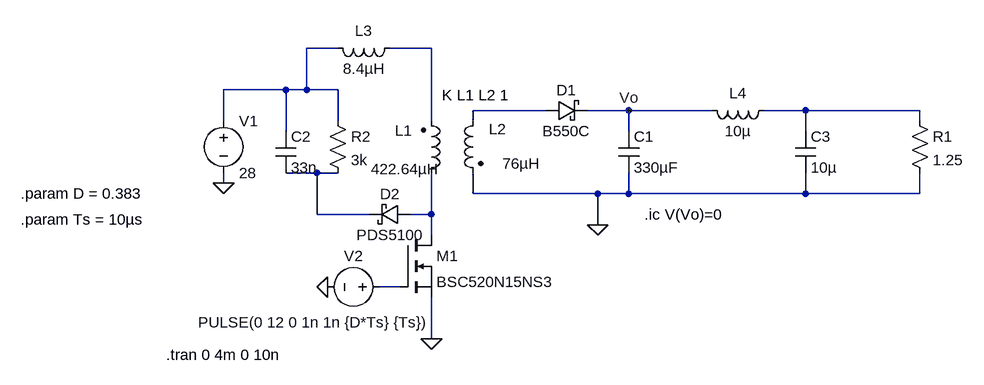
[diagram p0: schematic Flyback_Converter_2nd_Draft.asc]
Flyback_Converter_2nd_Draft.asc, the LTspice schematic file:
Version 4
SHEET 1 1176 680
WIRE 16 -32 -32 -32
WIRE 160 -32 96 -32
WIRE -64 32 -160 32
WIRE -32 32 -32 -32
WIRE -32 32 -64 32
WIRE 16 32 -32 32
WIRE 336 64 224 64
WIRE 464 64 400 64
WIRE 592 64 464 64
WIRE 736 64 672 64
WIRE 912 64 736 64
WIRE -160 80 -160 32
WIRE 16 80 16 32
WIRE 160 80 160 -32
WIRE 224 80 224 64
WIRE 912 80 912 64
WIRE -64 96 -64 32
WIRE 464 96 464 64
WIRE 736 96 736 64
WIRE -16 160 -64 160
WIRE 16 160 -16 160
WIRE -160 176 -160 160
WIRE 224 192 224 160
WIRE 416 192 224 192
WIRE 464 192 464 160
WIRE 464 192 416 192
WIRE 736 192 736 160
WIRE 736 192 464 192
WIRE 912 192 912 160
WIRE 912 192 736 192
WIRE -16 224 -16 160
WIRE 64 224 -16 224
WIRE 160 224 160 160
WIRE 160 224 128 224
WIRE 416 240 416 192
WIRE 160 256 160 224
WIRE 112 336 80 336
WIRE 160 416 160 352
FLAG -160 176 0
FLAG 0 336 0
FLAG 160 416 0
FLAG 416 240 0
FLAG 464 64 Vo
SYMBOL voltage -160 64 R0
WINDOW 123 0 0 Left 2
WINDOW 39 0 0 Left 2
SYMATTR InstName V1
SYMATTR Value 28
SYMBOL ind2 144 176 M180
WINDOW 0 -40 81 Left 2
WINDOW 3 -77 22 Left 2
SYMATTR InstName L1
SYMATTR Value 422.64µH
SYMATTR Type ind
SYMBOL ind2 240 64 M0
WINDOW 0 -36 29 Left 2
WINDOW 3 -87 82 Left 2
SYMATTR InstName L2
SYMATTR Value 76µH
SYMATTR Type ind
SYMBOL schottky 336 80 R270
WINDOW 0 32 32 VTop 2
WINDOW 3 0 32 VBottom 2
SYMATTR InstName D1
SYMATTR Value B550C
SYMATTR Description Diode
SYMATTR Type diode
SYMBOL cap 448 96 R0
SYMATTR InstName C1
SYMATTR Value 330µF
SYMATTR SpiceLine Rser=10m
SYMBOL nmos 112 256 R0
SYMATTR InstName M1
SYMATTR Value BSC520N15NS3
SYMBOL voltage 96 336 R90
WINDOW 0 -32 56 VBottom 2
WINDOW 3 39 117 VTop 2
WINDOW 123 0 0 Left 2
WINDOW 39 0 0 Left 2
SYMATTR InstName V2
SYMATTR Value PULSE(0 12 0 1n 1n {D*Ts} {Ts})
SYMBOL ind 112 -48 R90
WINDOW 0 5 56 VBottom 2
WINDOW 3 32 56 VTop 2
SYMATTR InstName L3
SYMATTR Value 8.4µH
SYMBOL schottky 128 208 R90
WINDOW 0 0 32 VBottom 2
WINDOW 3 32 32 VTop 2
SYMATTR InstName D2
SYMATTR Value PDS5100
SYMATTR Description Diode
SYMATTR Type diode
SYMBOL res 0 64 R0
SYMATTR InstName R2
SYMATTR Value 3k
SYMBOL cap -80 96 R0
SYMATTR InstName C2
SYMATTR Value 33n
SYMBOL ind 688 48 R90
WINDOW 0 5 56 VBottom 2
WINDOW 3 32 56 VTop 2
SYMATTR InstName L4
SYMATTR Value 10µ
SYMATTR SpiceLine Rser=20m
SYMBOL cap 720 96 R0
SYMATTR InstName C3
SYMATTR Value 10µ
SYMBOL res 896 64 R0
SYMATTR InstName R1
SYMATTR Value 1.25
TEXT 176 40 Left 2 !K L1 L2 1
TEXT -472 192 Left 2 !.param D = 0.383
TEXT -472 232 Left 2 !.param Ts = 10µs
TEXT -248 440 Left 2 !.tran 0 4m 0 10n
TEXT 488 224 Left 2 !.ic V(Vo)=0

The netlist it stands for:
* Flyback_Converter_2nd_Draft.asc
V1 N001 0 28
L1 N006 N002 422.64µH
L2 N003 0 76µH
D1 N003 Vo B550C
C1 Vo 0 330µF Rser=10m
M1 N006 N007 0 0 BSC520N15NS3
V2 N007 0 PULSE(0 12 0 1n 1n {D*Ts} {Ts})
L3 N002 N001 8.4µH
D2 N006 N005 PDS5100
R2 N001 N005 3k
C2 N001 N005 33n
L4 N004 Vo 10µ Rser=20m
C3 N004 0 10µ
R1 N004 0 1.25
.model D D
.lib standard.dio
.model NMOS NMOS
.model PMOS PMOS
.lib standard.mos
K L1 L2 1
.param D = 0.383
.param Ts = 10µs
.tran 0 4m 0 10n
.ic V(Vo)=0
.backanno
.end